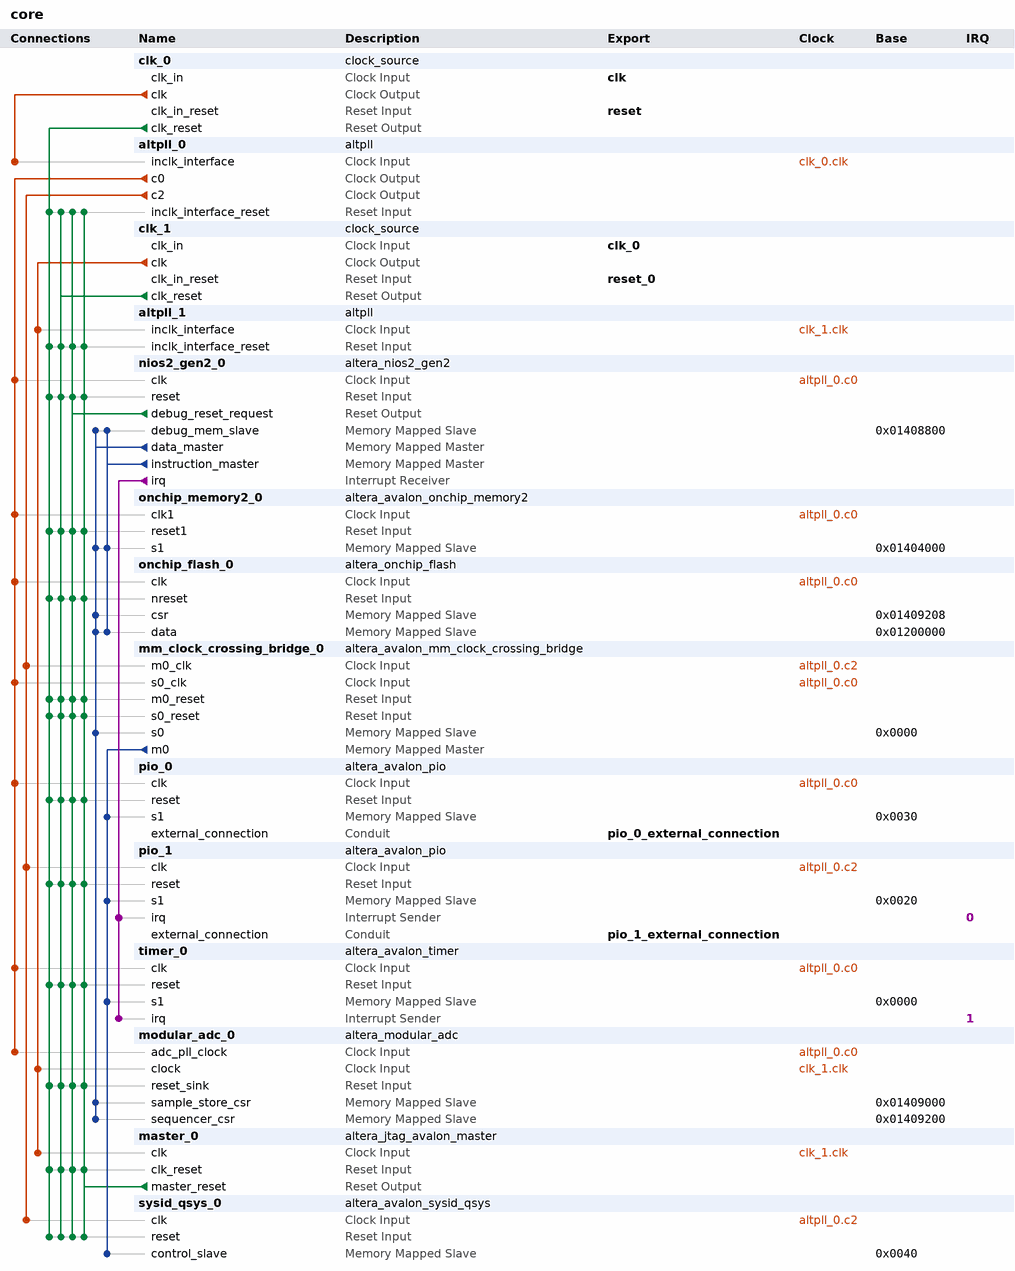
[diagram p0: system contents]
# Platform Designer (Qsys) system core, MAX 10 10M50DAF484C6GES
# Parameters at their usual value, and those the tool derives, are not listed.
package require -exact qsys 18.0
create_system core
set_project_property DEVICE_FAMILY {MAX 10}
set_project_property DEVICE 10M50DAF484C6GES

add_instance clk_0 clock_source 18.0
set_instance_parameter_value clk_0 clockFrequency 50000000

add_instance altpll_0 altpll 18.0
set_instance_parameter_value altpll_0 CLK0_DIVIDE_BY 5
set_instance_parameter_value altpll_0 CLK0_MULTIPLY_BY 8
set_instance_parameter_value altpll_0 CLK1_DIVIDE_BY 5
set_instance_parameter_value altpll_0 CLK1_DUTY_CYCLE 50
set_instance_parameter_value altpll_0 CLK1_MULTIPLY_BY 8
set_instance_parameter_value altpll_0 CLK1_PHASE_SHIFT -3125
set_instance_parameter_value altpll_0 CLK2_DIVIDE_BY 5
set_instance_parameter_value altpll_0 CLK2_DUTY_CYCLE 50
set_instance_parameter_value altpll_0 CLK2_MULTIPLY_BY 4
set_instance_parameter_value altpll_0 CLK2_PHASE_SHIFT 0
set_instance_parameter_value altpll_0 INCLK0_INPUT_FREQUENCY 20000
set_instance_parameter_value altpll_0 PORT_ARESET PORT_USED
set_instance_parameter_value altpll_0 PORT_LOCKED PORT_USED
set_instance_parameter_value altpll_0 PORT_clk1 PORT_USED
set_instance_parameter_value altpll_0 PORT_clk2 PORT_USED
set_instance_parameter_value altpll_0 PORT_clk3 PORT_UNUSED

add_instance clk_1 clock_source 18.0
set_instance_parameter_value clk_1 clockFrequency 10000000

add_instance altpll_1 altpll 18.0
set_instance_parameter_value altpll_1 CLK0_DIVIDE_BY 1
set_instance_parameter_value altpll_1 CLK0_MULTIPLY_BY 1
set_instance_parameter_value altpll_1 INCLK0_INPUT_FREQUENCY 100000
set_instance_parameter_value altpll_1 PORT_ARESET PORT_USED
set_instance_parameter_value altpll_1 PORT_LOCKED PORT_USED
set_instance_parameter_value altpll_1 PORT_clk1 PORT_UNUSED
set_instance_parameter_value altpll_1 PORT_clk2 PORT_UNUSED
set_instance_parameter_value altpll_1 PORT_clk3 PORT_UNUSED

add_instance nios2_gen2_0 altera_nios2_gen2 18.0
set_instance_parameter_value nios2_gen2_0 dcache_size 2048
set_instance_parameter_value nios2_gen2_0 debug_hwbreakpoint 2
set_instance_parameter_value nios2_gen2_0 exceptionSlave nios2_gen2_0.debug_mem_slave
set_instance_parameter_value nios2_gen2_0 icache_size 2048
set_instance_parameter_value nios2_gen2_0 impl Fast
set_instance_parameter_value nios2_gen2_0 resetSlave nios2_gen2_0.debug_mem_slave

add_instance onchip_memory2_0 altera_avalon_onchip_memory2 18.0
set_instance_parameter_value onchip_memory2_0 dataWidth 32
set_instance_parameter_value onchip_memory2_0 dualPort false
set_instance_parameter_value onchip_memory2_0 initMemContent true
set_instance_parameter_value onchip_memory2_0 initializationFileName onchip_mem.hex
set_instance_parameter_value onchip_memory2_0 memorySize 16384

add_instance onchip_flash_0 altera_onchip_flash 18.0
set_instance_parameter_value onchip_flash_0 CLOCK_FREQUENCY 80.0
set_instance_parameter_value onchip_flash_0 CONFIGURATION_MODE {Single Uncompressed Image with Memory Initialization}
set_instance_parameter_value onchip_flash_0 SECTOR_ACCESS_MODE {Read and write,Read and write,Read and write,Read and write,Read and write}
set_instance_parameter_value onchip_flash_0 initFlashContent false
set_instance_parameter_value onchip_flash_0 initializationFileName altera_onchip_flash.hex
set_instance_parameter_value onchip_flash_0 useNonDefaultInitFile false

add_instance mm_clock_crossing_bridge_0 altera_avalon_mm_clock_crossing_bridge 18.0
set_instance_parameter_value mm_clock_crossing_bridge_0 ADDRESS_UNITS WORDS
set_instance_parameter_value mm_clock_crossing_bridge_0 ADDRESS_WIDTH 10
set_instance_parameter_value mm_clock_crossing_bridge_0 COMMAND_FIFO_DEPTH 8
set_instance_parameter_value mm_clock_crossing_bridge_0 DATA_WIDTH 32
set_instance_parameter_value mm_clock_crossing_bridge_0 MASTER_SYNC_DEPTH 2
set_instance_parameter_value mm_clock_crossing_bridge_0 MAX_BURST_SIZE 1
set_instance_parameter_value mm_clock_crossing_bridge_0 RESPONSE_FIFO_DEPTH 32
set_instance_parameter_value mm_clock_crossing_bridge_0 SLAVE_SYNC_DEPTH 2
set_instance_parameter_value mm_clock_crossing_bridge_0 USE_AUTO_ADDRESS_WIDTH 0

add_instance pio_0 altera_avalon_pio 18.0
set_instance_parameter_value pio_0 direction Output
set_instance_parameter_value pio_0 width 10

add_instance pio_1 altera_avalon_pio 18.0
set_instance_parameter_value pio_1 captureEdge true
set_instance_parameter_value pio_1 direction Input
set_instance_parameter_value pio_1 edgeType ANY
set_instance_parameter_value pio_1 generateIRQ true
set_instance_parameter_value pio_1 simDoTestBenchWiring true
set_instance_parameter_value pio_1 simDrivenValue 1023
set_instance_parameter_value pio_1 width 10

add_instance timer_0 altera_avalon_timer 18.0
set_instance_parameter_value timer_0 period 1
set_instance_parameter_value timer_0 periodUnits MSEC

add_instance modular_adc_0 altera_modular_adc 18.0
set_instance_parameter_value modular_adc_0 CLOCK_FREQ 10000000
set_instance_parameter_value modular_adc_0 CORE_VAR 0
set_instance_parameter_value modular_adc_0 DEVICE_PART 10M50DAF484C6GES
set_instance_parameter_value modular_adc_0 ENABLE_DEBUG 1
set_instance_parameter_value modular_adc_0 clkdiv 2
set_instance_parameter_value modular_adc_0 int_vref_vr 3.0
set_instance_parameter_value modular_adc_0 refsel 0
set_instance_parameter_value modular_adc_0 sample_rate 0
set_instance_parameter_value modular_adc_0 seq_order_length 1
set_instance_parameter_value modular_adc_0 seq_order_slot_1 1
set_instance_parameter_value modular_adc_0 seq_order_slot_2 30
set_instance_parameter_value modular_adc_0 seq_order_slot_3 30
set_instance_parameter_value modular_adc_0 seq_order_slot_4 30
set_instance_parameter_value modular_adc_0 seq_order_slot_5 30
set_instance_parameter_value modular_adc_0 seq_order_slot_6 30
set_instance_parameter_value modular_adc_0 seq_order_slot_7 30
set_instance_parameter_value modular_adc_0 use_ch0 false
set_instance_parameter_value modular_adc_0 use_ch2 false
set_instance_parameter_value modular_adc_0 use_ch3 false
set_instance_parameter_value modular_adc_0 use_ch4 false
set_instance_parameter_value modular_adc_0 use_ch5 false
set_instance_parameter_value modular_adc_0 use_ch6 false
set_instance_parameter_value modular_adc_0 use_ch7 false
set_instance_parameter_value modular_adc_0 use_ch8 false
set_instance_parameter_value modular_adc_0 use_tsd false

add_instance master_0 altera_jtag_avalon_master 18.0

add_instance sysid_qsys_0 altera_avalon_sysid_qsys 18.0
set_instance_parameter_value sysid_qsys_0 id 43981

# connections
add_connection altpll_0.c0 mm_clock_crossing_bridge_0.s0_clk clock
add_connection altpll_0.c0 modular_adc_0.adc_pll_clock clock
add_connection altpll_0.c0 nios2_gen2_0.clk clock
add_connection altpll_0.c0 onchip_flash_0.clk clock
add_connection altpll_0.c0 onchip_memory2_0.clk1 clock
add_connection altpll_0.c0 pio_0.clk clock
add_connection altpll_0.c0 timer_0.clk clock
add_connection altpll_0.c2 mm_clock_crossing_bridge_0.m0_clk clock
add_connection altpll_0.c2 pio_1.clk clock
add_connection altpll_0.c2 sysid_qsys_0.clk clock
add_connection clk_0.clk altpll_0.inclk_interface clock
add_connection clk_1.clk altpll_1.inclk_interface clock
add_connection clk_1.clk master_0.clk clock
add_connection clk_1.clk modular_adc_0.clock clock
add_connection clk_0.clk_reset altpll_0.inclk_interface_reset reset
add_connection clk_0.clk_reset altpll_1.inclk_interface_reset reset
add_connection clk_0.clk_reset master_0.clk_reset reset
add_connection clk_0.clk_reset mm_clock_crossing_bridge_0.m0_reset reset
add_connection clk_0.clk_reset mm_clock_crossing_bridge_0.s0_reset reset
add_connection clk_0.clk_reset modular_adc_0.reset_sink reset
add_connection clk_0.clk_reset nios2_gen2_0.reset reset
add_connection clk_0.clk_reset onchip_flash_0.nreset reset
add_connection clk_0.clk_reset onchip_memory2_0.reset1 reset
add_connection clk_0.clk_reset pio_0.reset reset
add_connection clk_0.clk_reset pio_1.reset reset
add_connection clk_0.clk_reset sysid_qsys_0.reset reset
add_connection clk_0.clk_reset timer_0.reset reset
add_connection clk_1.clk_reset altpll_0.inclk_interface_reset reset
add_connection clk_1.clk_reset altpll_1.inclk_interface_reset reset
add_connection clk_1.clk_reset master_0.clk_reset reset
add_connection clk_1.clk_reset mm_clock_crossing_bridge_0.m0_reset reset
add_connection clk_1.clk_reset mm_clock_crossing_bridge_0.s0_reset reset
add_connection clk_1.clk_reset modular_adc_0.reset_sink reset
add_connection clk_1.clk_reset nios2_gen2_0.reset reset
add_connection clk_1.clk_reset onchip_flash_0.nreset reset
add_connection clk_1.clk_reset onchip_memory2_0.reset1 reset
add_connection clk_1.clk_reset pio_0.reset reset
add_connection clk_1.clk_reset pio_1.reset reset
add_connection clk_1.clk_reset sysid_qsys_0.reset reset
add_connection clk_1.clk_reset timer_0.reset reset
add_connection master_0.master_reset altpll_0.inclk_interface_reset reset
add_connection master_0.master_reset altpll_1.inclk_interface_reset reset
add_connection master_0.master_reset master_0.clk_reset reset
add_connection master_0.master_reset mm_clock_crossing_bridge_0.m0_reset reset
add_connection master_0.master_reset mm_clock_crossing_bridge_0.s0_reset reset
add_connection master_0.master_reset modular_adc_0.reset_sink reset
add_connection master_0.master_reset nios2_gen2_0.reset reset
add_connection master_0.master_reset onchip_flash_0.nreset reset
add_connection master_0.master_reset onchip_memory2_0.reset1 reset
add_connection master_0.master_reset pio_0.reset reset
add_connection master_0.master_reset pio_1.reset reset
add_connection master_0.master_reset sysid_qsys_0.reset reset
add_connection master_0.master_reset timer_0.reset reset
add_connection nios2_gen2_0.debug_reset_request altpll_0.inclk_interface_reset reset
add_connection nios2_gen2_0.debug_reset_request altpll_1.inclk_interface_reset reset
add_connection nios2_gen2_0.debug_reset_request master_0.clk_reset reset
add_connection nios2_gen2_0.debug_reset_request mm_clock_crossing_bridge_0.m0_reset reset
add_connection nios2_gen2_0.debug_reset_request mm_clock_crossing_bridge_0.s0_reset reset
add_connection nios2_gen2_0.debug_reset_request modular_adc_0.reset_sink reset
add_connection nios2_gen2_0.debug_reset_request nios2_gen2_0.reset reset
add_connection nios2_gen2_0.debug_reset_request onchip_flash_0.nreset reset
add_connection nios2_gen2_0.debug_reset_request onchip_memory2_0.reset1 reset
add_connection nios2_gen2_0.debug_reset_request pio_0.reset reset
add_connection nios2_gen2_0.debug_reset_request pio_1.reset reset
add_connection nios2_gen2_0.debug_reset_request sysid_qsys_0.reset reset
add_connection nios2_gen2_0.debug_reset_request timer_0.reset reset
add_connection mm_clock_crossing_bridge_0.m0 pio_0.s1 avalon
set_connection_parameter_value mm_clock_crossing_bridge_0.m0/pio_0.s1 baseAddress 0x0030
add_connection mm_clock_crossing_bridge_0.m0 pio_1.s1 avalon
set_connection_parameter_value mm_clock_crossing_bridge_0.m0/pio_1.s1 baseAddress 0x0020
add_connection mm_clock_crossing_bridge_0.m0 sysid_qsys_0.control_slave avalon
set_connection_parameter_value mm_clock_crossing_bridge_0.m0/sysid_qsys_0.control_slave baseAddress 0x0040
add_connection mm_clock_crossing_bridge_0.m0 timer_0.s1 avalon
set_connection_parameter_value mm_clock_crossing_bridge_0.m0/timer_0.s1 baseAddress 0x0000
add_connection nios2_gen2_0.data_master mm_clock_crossing_bridge_0.s0 avalon
set_connection_parameter_value nios2_gen2_0.data_master/mm_clock_crossing_bridge_0.s0 baseAddress 0x0000
add_connection nios2_gen2_0.data_master modular_adc_0.sample_store_csr avalon
set_connection_parameter_value nios2_gen2_0.data_master/modular_adc_0.sample_store_csr baseAddress 0x01409000
add_connection nios2_gen2_0.data_master modular_adc_0.sequencer_csr avalon
set_connection_parameter_value nios2_gen2_0.data_master/modular_adc_0.sequencer_csr baseAddress 0x01409200
add_connection nios2_gen2_0.data_master nios2_gen2_0.debug_mem_slave avalon
set_connection_parameter_value nios2_gen2_0.data_master/nios2_gen2_0.debug_mem_slave baseAddress 0x01408800
add_connection nios2_gen2_0.data_master onchip_flash_0.csr avalon
set_connection_parameter_value nios2_gen2_0.data_master/onchip_flash_0.csr baseAddress 0x01409208
add_connection nios2_gen2_0.data_master onchip_flash_0.data avalon
set_connection_parameter_value nios2_gen2_0.data_master/onchip_flash_0.data baseAddress 0x01200000
add_connection nios2_gen2_0.data_master onchip_memory2_0.s1 avalon
set_connection_parameter_value nios2_gen2_0.data_master/onchip_memory2_0.s1 baseAddress 0x01404000
add_connection nios2_gen2_0.instruction_master nios2_gen2_0.debug_mem_slave avalon
set_connection_parameter_value nios2_gen2_0.instruction_master/nios2_gen2_0.debug_mem_slave baseAddress 0x01408800
add_connection nios2_gen2_0.instruction_master onchip_flash_0.data avalon
set_connection_parameter_value nios2_gen2_0.instruction_master/onchip_flash_0.data baseAddress 0x01200000
add_connection nios2_gen2_0.instruction_master onchip_memory2_0.s1 avalon
set_connection_parameter_value nios2_gen2_0.instruction_master/onchip_memory2_0.s1 baseAddress 0x01404000
add_connection nios2_gen2_0.irq pio_1.irq interrupt
set_connection_parameter_value nios2_gen2_0.irq/pio_1.irq irqNumber 0
add_connection nios2_gen2_0.irq timer_0.irq interrupt
set_connection_parameter_value nios2_gen2_0.irq/timer_0.irq irqNumber 1

# exported interfaces
add_interface clk clock sink
set_interface_property clk EXPORT_OF clk_0.clk_in
add_interface clk_0 clock sink
set_interface_property clk_0 EXPORT_OF clk_1.clk_in
add_interface pio_0_external_connection conduit end
set_interface_property pio_0_external_connection EXPORT_OF pio_0.external_connection
add_interface pio_1_external_connection conduit end
set_interface_property pio_1_external_connection EXPORT_OF pio_1.external_connection
add_interface reset reset sink
set_interface_property reset EXPORT_OF clk_0.clk_in_reset
add_interface reset_0 reset sink
set_interface_property reset_0 EXPORT_OF clk_1.clk_in_reset

set_interconnect_requirement {$system} qsys_mm.clockCrossingAdapter HANDSHAKE
set_interconnect_requirement {$system} qsys_mm.enableEccProtection FALSE
set_interconnect_requirement {$system} qsys_mm.insertDefaultSlave FALSE
set_interconnect_requirement {$system} qsys_mm.maxAdditionalLatency 1

save_system core.qsys
